# EAGLE design SRAM_MODULE 2.0a (EAGLE 7.2.0)
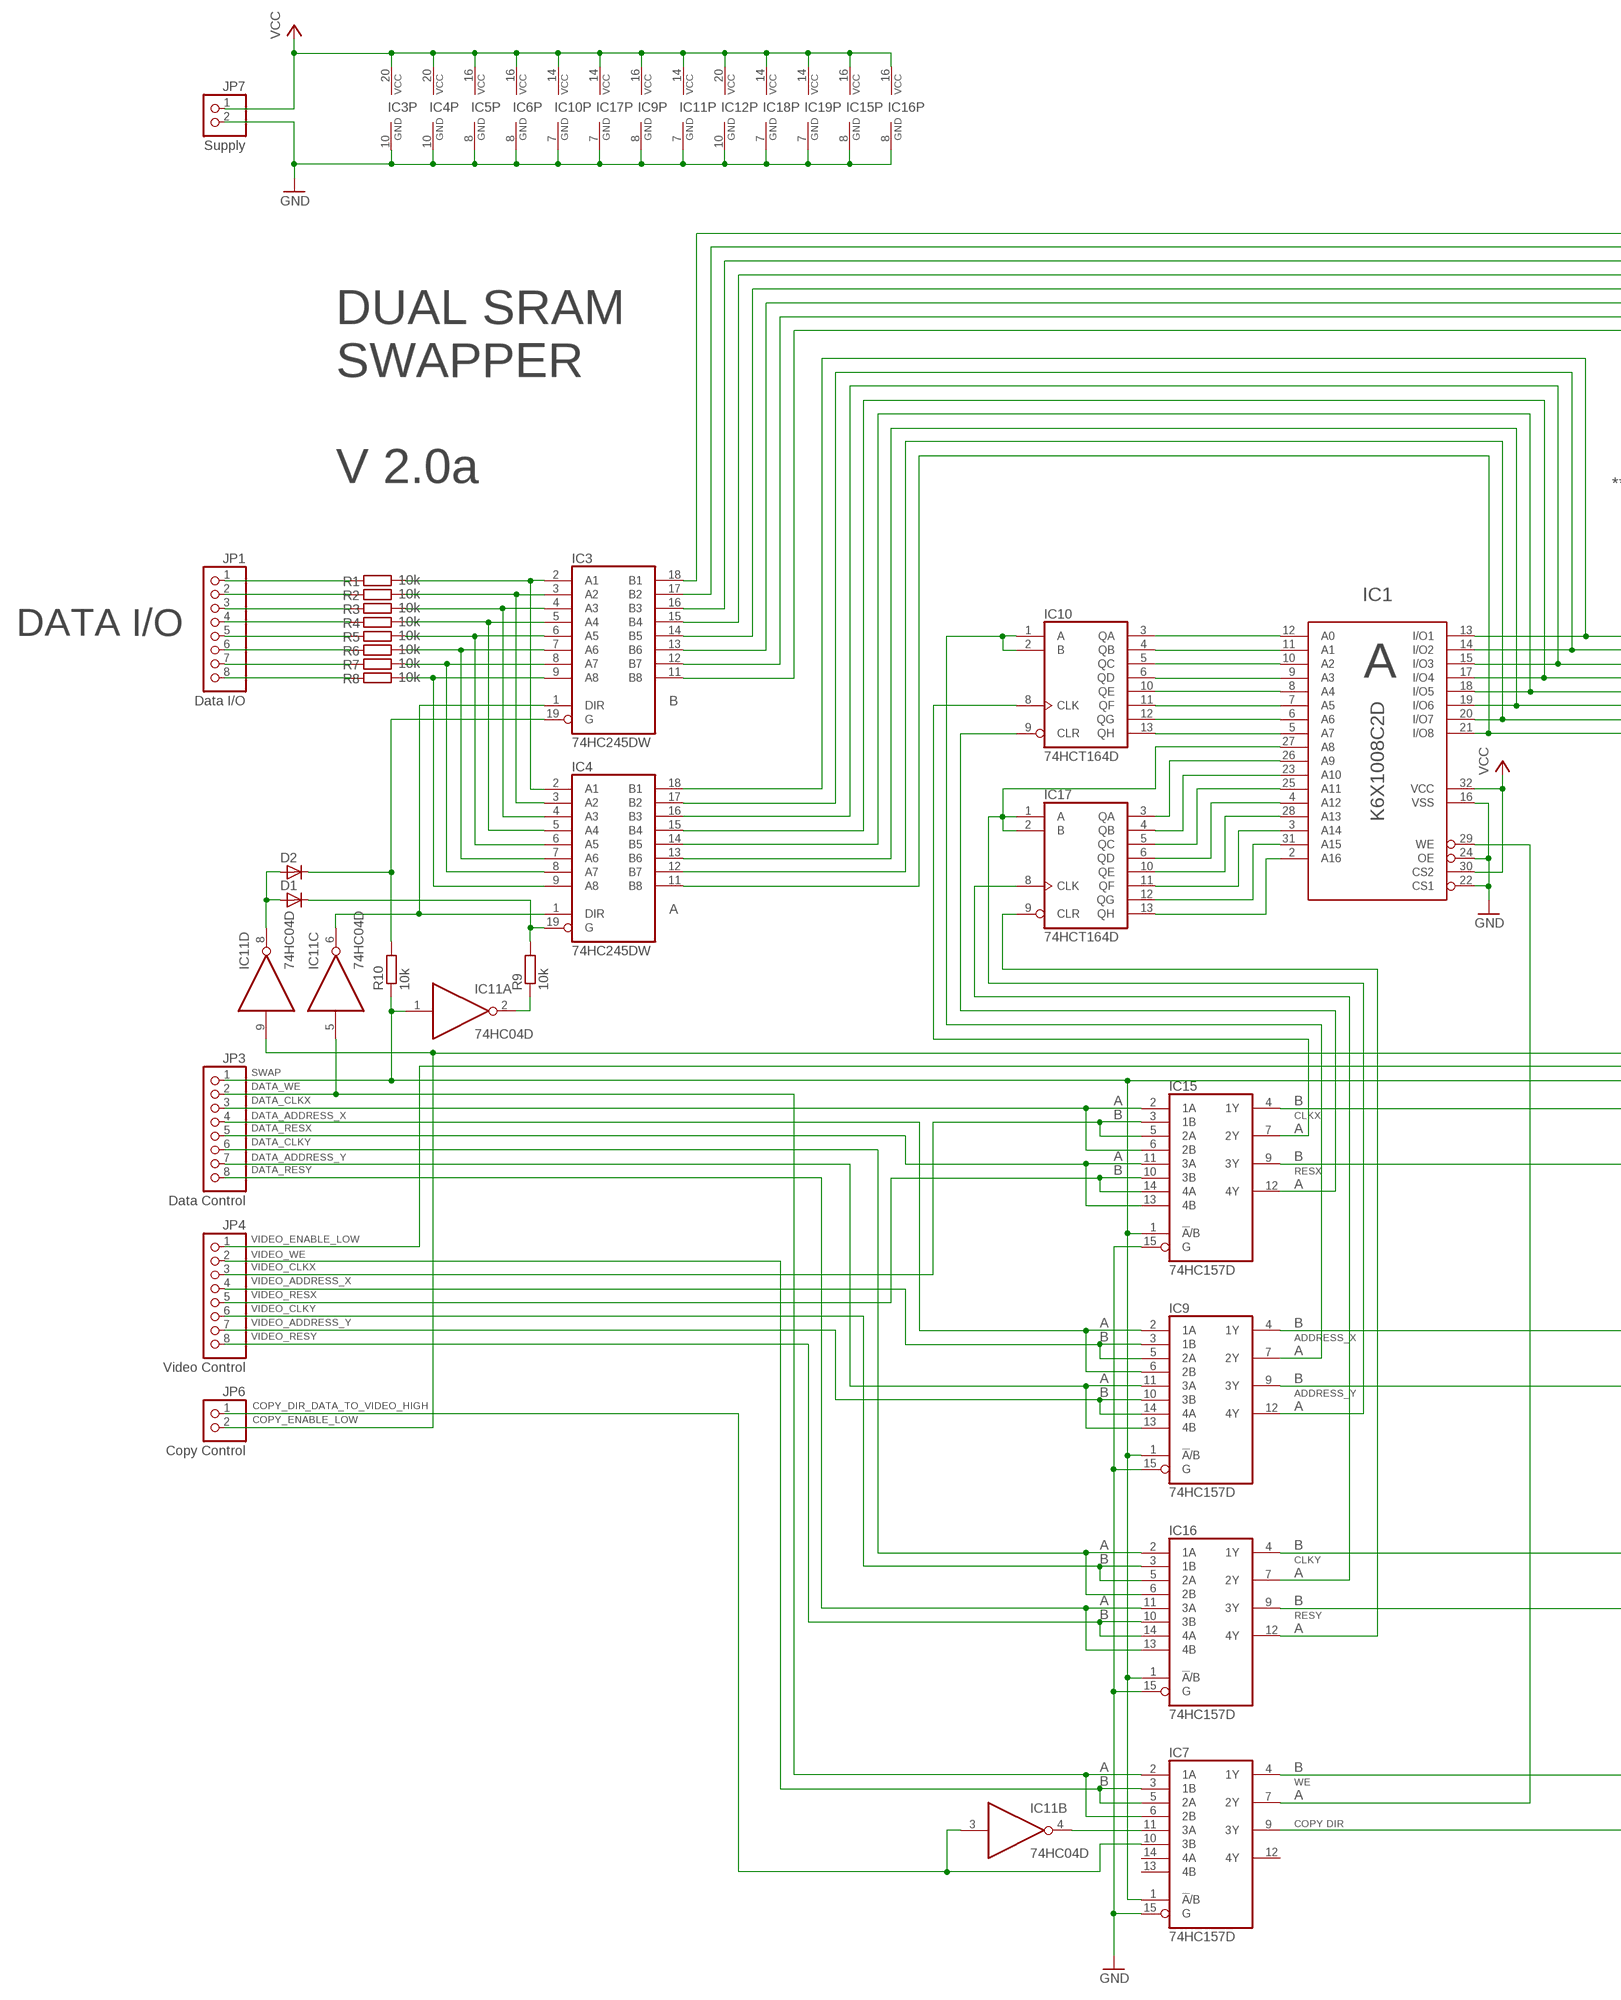
[diagram p0: schematic, sheet 1, part 1 of 2]
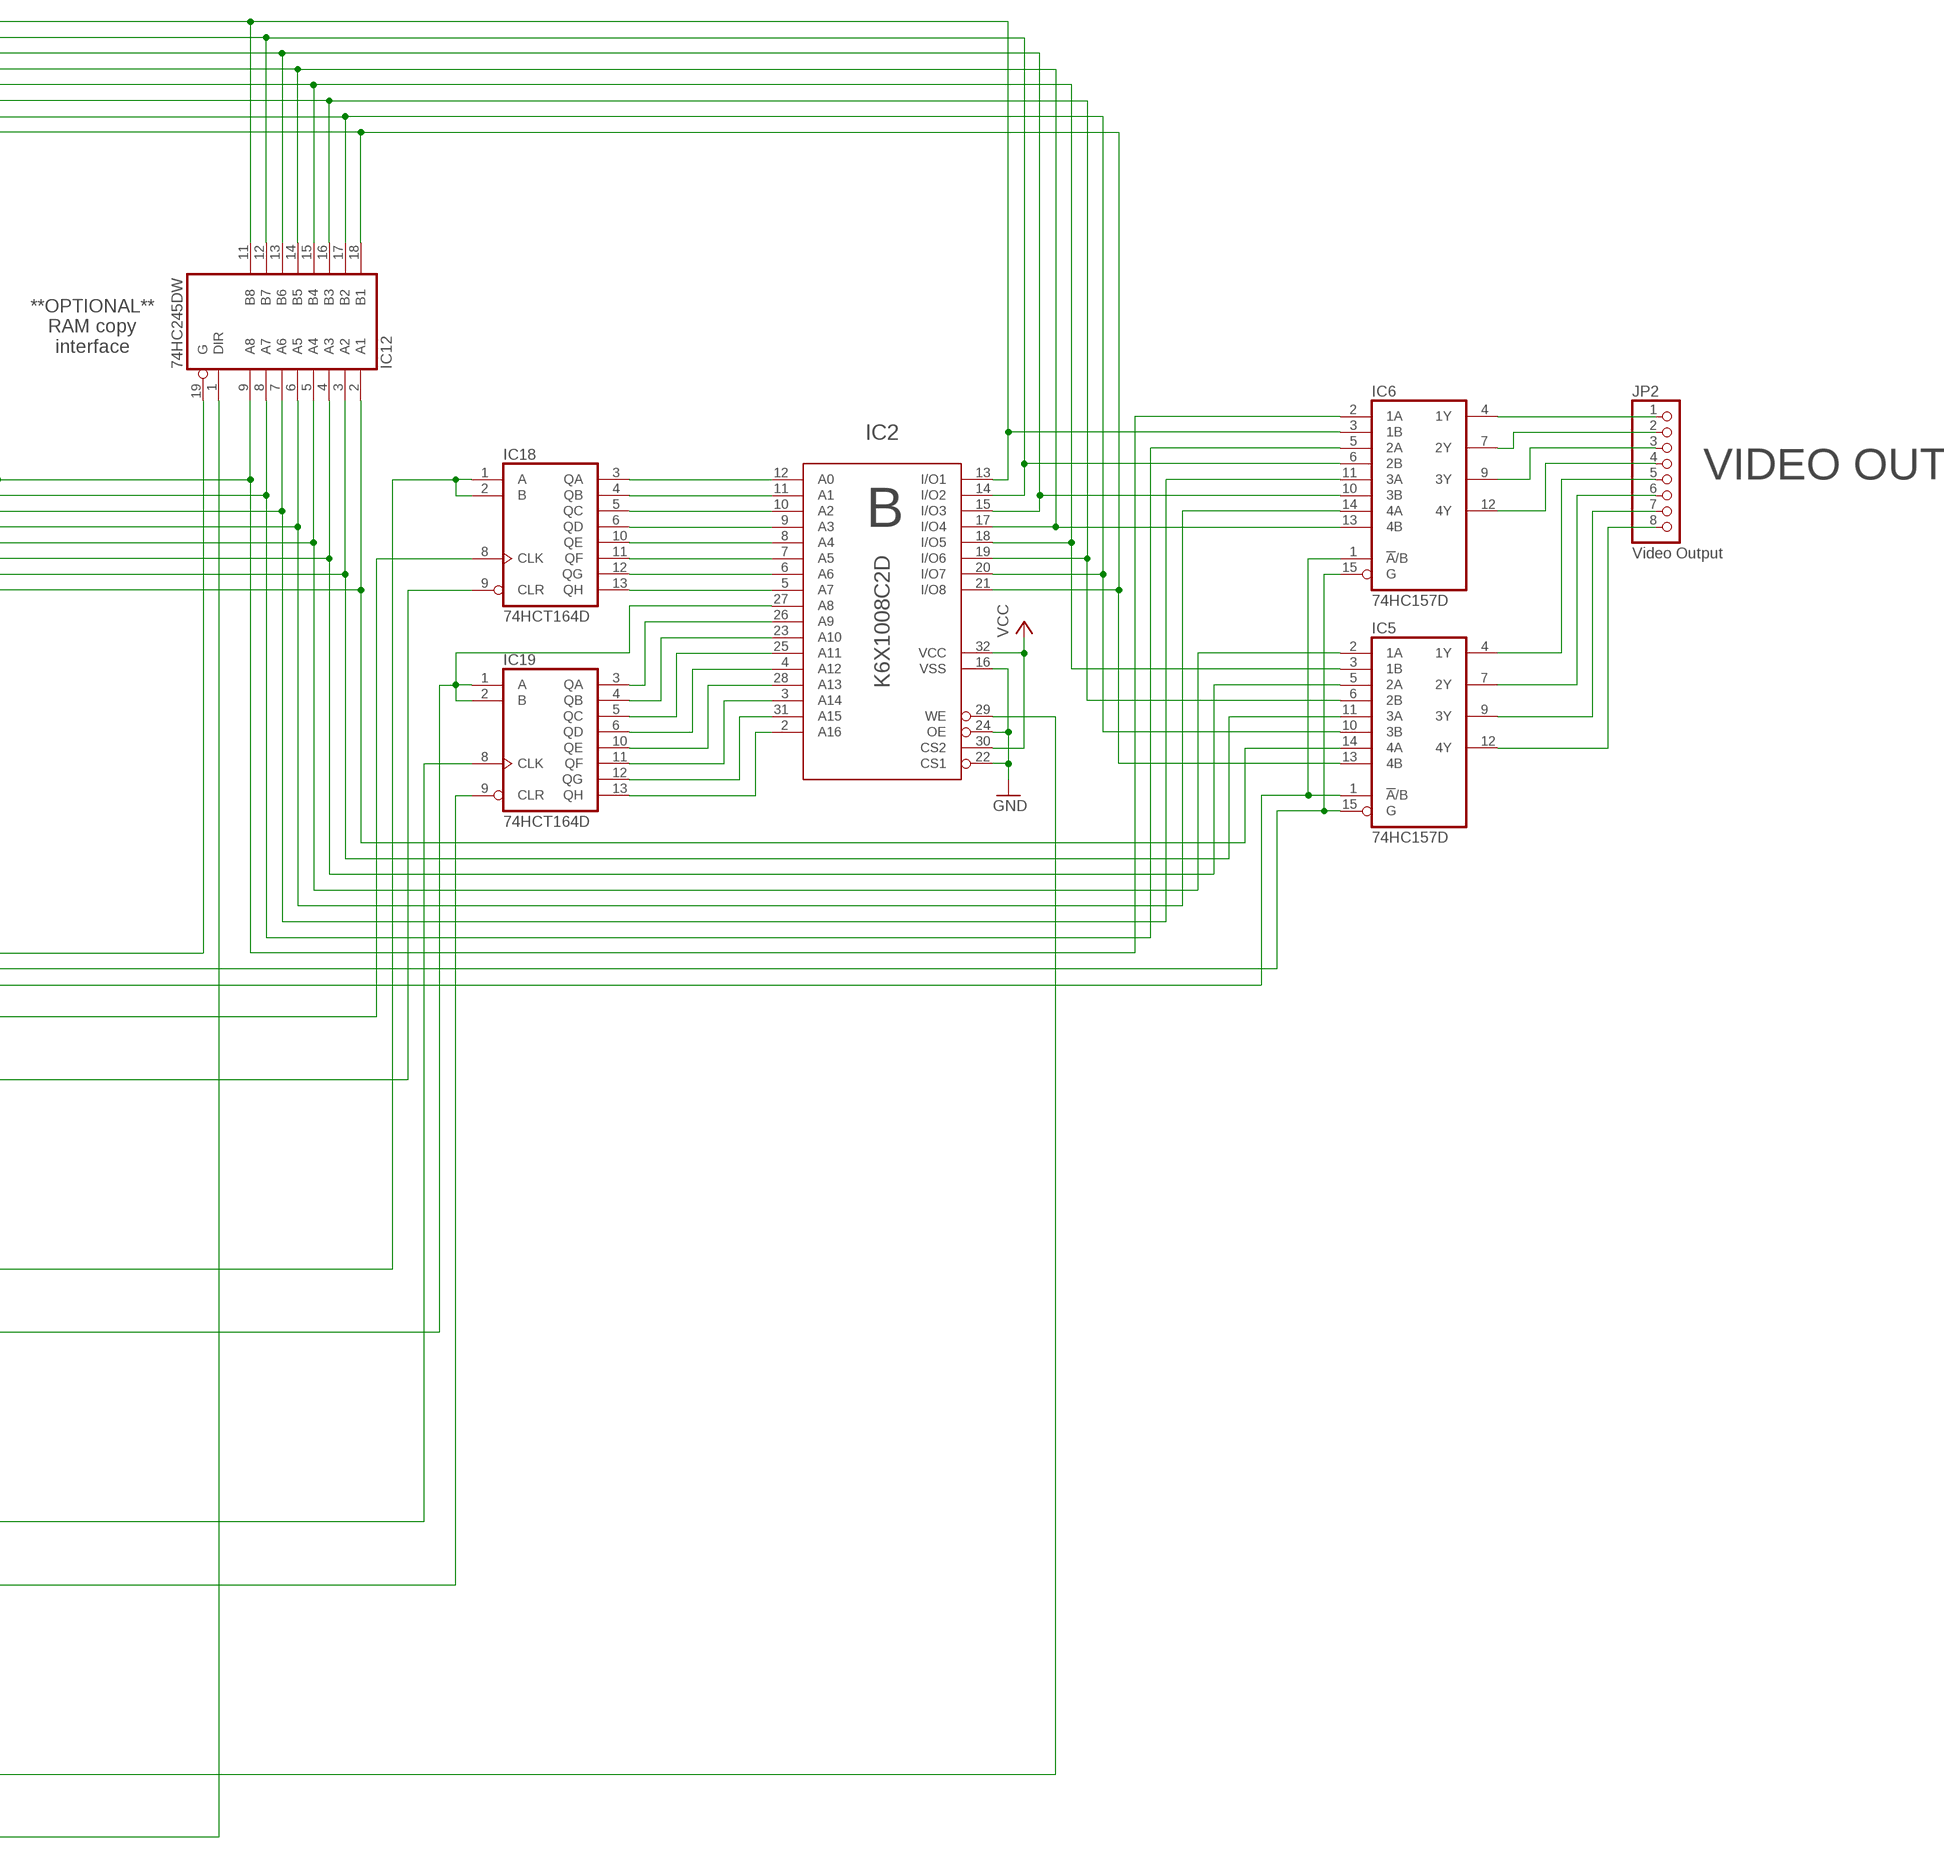
[diagram p1: schematic, sheet 1, part 2 of 2]

## Parts
D1  D-A1-C3  [SOT23]
D2  D-A1-C3  [SOT23]
IC1  K6X1008C2D  [SOP32-5]
IC2  K6X1008C2D  [SOP32-5]
IC3  74HC245DW  [SO20W]
IC4  74HC245DW  [SO20W]
IC5  74HC157D  [SO16]
IC6  74HC157D  [SO16]
IC7  74HC157D  [SO16]
IC9  74HC157D  [SO16]
IC10  74HCT164D  [SO14]
IC11  74HC04D  [SO14]
IC12  74HC245DW  [SO20W]
IC15  74HC157D  [SO16]
IC16  74HC157D  [SO16]
IC17  74HCT164D  [SO14]
IC18  74HCT164D  [SO14]
IC19  74HCT164D  [SO14]
JP1  Data I/O  PINHD-1X8  [1X08]
JP2  Video Output  PINHD-1X8  [1X08]
JP3  Data Control  PINHD-1X8  [1X08]
JP4  Video Control  PINHD-1X8  [1X08]
JP6  Copy Control  PINHD-1X2  [1X02]
JP7  Supply  PINHD-1X2  [1X02]
R1  10k  R-EU_R0603  [R0603]
R2  10k  R-EU_R0603  [R0603]
R3  10k  R-EU_R0603  [R0603]
R4  10k  R-EU_R0603  [R0603]
R5  10k  R-EU_R0603  [R0603]
R6  10k  R-EU_R0603  [R0603]
R7  10k  R-EU_R0603  [R0603]
R8  10k  R-EU_R0603  [R0603]
R9  10k  R-EU_R0603  [R0603]
R10  10k  R-EU_R0603  [R0603]

## Nets
A_ADDRESS_X: IC9.7(2Y) IC10.1(A) IC10.2(B)
A_ADDRESS_Y: IC1.27(A8) IC9.12(4Y) IC17.1(A) IC17.2(B)
A_CLKX: IC10.8(CLK) IC15.7(2Y)
A_CLKY: IC16.7(2Y) IC17.8(CLK)
A_I/O1: IC1.13(I/O1) IC4.18(B1) IC6.2(1A) IC12.9(A8)
A_I/O2: IC1.14(I/O2) IC4.17(B2) IC6.5(2A) IC12.8(A7)
A_I/O3: IC1.15(I/O3) IC4.16(B3) IC6.11(3A) IC12.7(A6)
A_I/O4: IC1.17(I/O4) IC4.15(B4) IC6.14(4A) IC12.6(A5)
A_I/O5: IC1.18(I/O5) IC4.14(B5) IC5.2(1A) IC12.5(A4)
A_I/O6: IC1.19(I/O6) IC4.13(B6) IC5.5(2A) IC12.4(A3)
A_I/O7: IC1.20(I/O7) IC4.12(B7) IC5.11(3A) IC12.3(A2)
A_I/O8: IC1.21(I/O8) IC4.11(B8) IC5.14(4A) IC12.2(A1)
A_RESX: IC10.9(CLR) IC15.12(4Y)
A_RESY: IC16.12(4Y) IC17.9(CLR)
A_WE: IC1.29(WE) IC7.7(2Y)
B_ADDRESS_X: IC9.4(1Y) IC18.1(A) IC18.2(B)
B_ADDRESS_Y: IC2.27(A8) IC9.9(3Y) IC19.1(A) IC19.2(B)
B_CLKX: IC15.4(1Y) IC18.8(CLK)
B_CLKY: IC16.4(1Y) IC19.8(CLK)
B_I/O1: IC2.13(I/O1) IC3.18(B1) IC6.3(1B) IC12.11(B8)
B_I/O2: IC2.14(I/O2) IC3.17(B2) IC6.6(2B) IC12.12(B7)
B_I/O3: IC2.15(I/O3) IC3.16(B3) IC6.10(3B) IC12.13(B6)
B_I/O4: IC2.17(I/O4) IC3.15(B4) IC6.13(4B) IC12.14(B5)
B_I/O5: IC2.18(I/O5) IC3.14(B5) IC5.3(1B) IC12.15(B4)
B_I/O6: IC2.19(I/O6) IC3.13(B6) IC5.6(2B) IC12.16(B3)
B_I/O7: IC2.20(I/O7) IC3.12(B7) IC5.10(3B) IC12.17(B2)
B_I/O8: IC2.21(I/O8) IC3.11(B8) IC5.13(4B) IC12.18(B1)
B_RESX: IC15.9(3Y) IC18.9(CLR)
B_RESY: IC16.9(3Y) IC19.9(CLR)
B_WE: IC2.29(WE) IC7.4(1Y)
COPY_DIR_DATA_TO_VIDEO_HIGH: IC7.10(3B) IC11.3(B:I) JP6.1
COPY_ENABLE_LOW: IC11.9(D:I) IC12.19(G) JP6.2
DATA_ADDRESS_X: IC9.2(1A) IC9.6(2B) JP3.4
DATA_ADDRESS_Y: IC9.11(3A) IC9.13(4B) JP3.7
DATA_CLKX: IC15.2(1A) IC15.6(2B) JP3.3
DATA_CLKY: IC16.2(1A) IC16.6(2B) JP3.6
DATA_RESX: IC15.11(3A) IC15.13(4B) JP3.5
DATA_RESY: IC16.11(3A) IC16.13(4B) JP3.8
DATA_WE: IC7.2(1A) IC7.6(2B) IC11.5(C:I) JP3.2
GND: IC1.16(VSS) IC1.22(CS1) IC1.24(OE) IC2.16(VSS) IC2.22(CS1) IC2.24(OE) IC3.10(GND) IC4.10(GND) IC5.8(GND) IC6.8(GND) IC7.15(G) IC9.8(GND) IC9.15(G) IC10.7(GND) IC11.7(P:GND) IC12.10(GND) IC15.8(GND) IC15.15(G) IC16.8(GND) IC16.15(G) IC17.7(GND) IC18.7(GND) IC19.7(GND) JP7.2
INTERNAL_COPY_DIRECTION: IC7.9(3Y) IC12.1(DIR)
IO1: IC3.2(A1) IC4.2(A1) R1.2
IO2: IC3.3(A2) IC4.3(A2) R2.2
IO3: IC3.4(A3) IC4.4(A3) R3.2
IO4: IC3.5(A4) IC4.5(A4) R4.2
IO5: IC3.6(A5) IC4.6(A5) R5.2
IO6: IC3.7(A6) IC4.7(A6) R6.2
IO7: IC3.8(A7) IC4.8(A7) R7.2
IO8: IC3.9(A8) IC4.9(A8) R8.2
N$1: IC1.12(A0) IC10.3(QA)
N$2: IC7.11(3A) IC11.4(B:O)
N$3: D2.3(C) IC3.19(G) R10.2
N$4: D1.3(C) IC4.19(G) R9.2
N$5: IC1.11(A1) IC10.4(QB)
N$6: IC1.28(A13) IC17.10(QE)
N$7: IC1.10(A2) IC10.5(QC)
N$8: IC1.9(A3) IC10.6(QD)
N$9: IC1.8(A4) IC10.10(QE)
N$10: D1.1(A) D2.1(A) IC11.8(D:O)
N$11: IC1.7(A5) IC10.11(QF)
N$12: IC1.6(A6) IC10.12(QG)
N$13: JP1.8 R8.1
N$14: JP1.7 R7.1
N$15: JP1.6 R6.1
N$16: JP1.5 R5.1
N$17: IC1.5(A7) IC10.13(QH)
N$18: JP1.4 R4.1
N$19: IC1.26(A9) IC17.3(QA)
N$20: IC1.23(A10) IC17.4(QB)
N$21: IC1.25(A11) IC17.5(QC)
N$22: IC1.4(A12) IC17.6(QD)
N$23: IC1.3(A14) IC17.11(QF)
N$24: IC1.31(A15) IC17.12(QG)
N$25: IC1.2(A16) IC17.13(QH)
N$26: JP1.3 R3.1
N$27: IC2.26(A9) IC19.3(QA)
N$28: IC2.23(A10) IC19.4(QB)
N$29: IC2.25(A11) IC19.5(QC)
N$30: IC2.4(A12) IC19.6(QD)
N$31: IC2.28(A13) IC19.10(QE)
N$32: IC2.3(A14) IC19.11(QF)
N$33: IC2.31(A15) IC19.12(QG)
N$34: IC2.2(A16) IC19.13(QH)
N$35: IC2.12(A0) IC18.3(QA)
N$36: IC2.11(A1) IC18.4(QB)
N$37: IC2.10(A2) IC18.5(QC)
N$38: IC2.9(A3) IC18.6(QD)
N$39: IC2.8(A4) IC18.10(QE)
N$40: JP1.2 R2.1
N$41: IC2.7(A5) IC18.11(QF)
N$42: IC2.6(A6) IC18.12(QG)
N$43: IC3.1(DIR) IC4.1(DIR) IC11.6(C:O)
N$44: IC2.5(A7) IC18.13(QH)
N$45: IC11.2(A:O) R9.1
N$46: JP1.1 R1.1
O1: IC6.4(1Y) JP2.1
O2: IC6.7(2Y) JP2.2
O3: IC6.9(3Y) JP2.3
O4: IC6.12(4Y) JP2.4
O5: IC5.4(1Y) JP2.5
O6: IC5.7(2Y) JP2.6
O7: IC5.9(3Y) JP2.7
O8: IC5.12(4Y) JP2.8
SWAP: IC5.1(!A!/B) IC6.1(!A!/B) IC7.1(!A!/B) IC9.1(!A!/B) IC11.1(A:I) IC15.1(!A!/B) IC16.1(!A!/B) JP3.1 R10.1
VCC: IC1.30(CS2) IC1.32(VCC) IC2.30(CS2) IC2.32(VCC) IC3.20(VCC) IC4.20(VCC) IC5.16(VCC) IC6.16(VCC) IC9.16(VCC) IC10.14(VCC) IC11.14(P:VCC) IC12.20(VCC) IC15.16(VCC) IC16.16(VCC) IC17.14(VCC) IC18.14(VCC) IC19.14(VCC) JP7.1
VIDEO_ADDRESS_X: IC9.3(1B) IC9.5(2A) JP4.4
VIDEO_ADDRESS_Y: IC9.10(3B) IC9.14(4A) JP4.7
VIDEO_CLKX: IC15.3(1B) IC15.5(2A) JP4.3
VIDEO_CLKY: IC16.3(1B) IC16.5(2A) JP4.6
VIDEO_ENABLE_LOW: IC5.15(G) IC6.15(G) JP4.1
VIDEO_RESX: IC15.10(3B) IC15.14(4A) JP4.5
VIDEO_RESY: IC16.10(3B) IC16.14(4A) JP4.8
VIDEO_WE: IC7.3(1B) IC7.5(2A) JP4.2
Unconnected: IC7.12(4Y) IC7.13(4B) IC7.14(4A) IC11.10(E:O) IC11.11(E:I) IC11.12(F:O) IC11.13(F:I)

## Notes on the sheet
- DUAL SRAM
  SWAPPER
  
  V 2.0a
- **OPTIONAL**
  RAM copy
  interface
- DATA I/O | VIDEO OUT
- A | B
- B
- A
- A | B
- B | CLKX
- A
- A | B
- B | RESX
- A
- A | B
- B | ADDRESS_X
- A
- A | B
- B | ADDRESS_Y
- A
- A | B
- B | CLKY
- A
- A | B
- B | RESY
- A
- A | B
- B | WE
- A
- COPY DIR

## Power pins joined to a net without a drawn wire
GND: IC7.8(GND)
VCC: IC7.16(VCC)

## Library data of the parts
D1 D2 = semicon-smd-ipc:D-: DIODE unfilled
IC1 IC2 = SRAM:K6X1008C2D: Static RAM SOP32-5; IC1: K6X1008C2D-B
IC3 IC4 IC12 = 74xx-eu:74*245: Octal BUS TRANSCEIVER, 3-state
IC5-IC7 IC9 IC15 IC16 = 74xx-eu:74*157: Quadruple 2-line to 1-line data SELECTOR/MULTIPLEXER
IC10 IC17-IC19 = 74xx-eu:74*164: 8-bit parallel out SHIFT REGISTER
IC11 = 74xx-eu:74*04: Hex INVERTER
JP1-JP4 = pinhead:PINHD-1X8: PIN HEADER
JP6 JP7 = pinhead:PINHD-1X2: PIN HEADER
R1-R10 = rcl:R-EU_: RESISTOR, European symbol

## Board
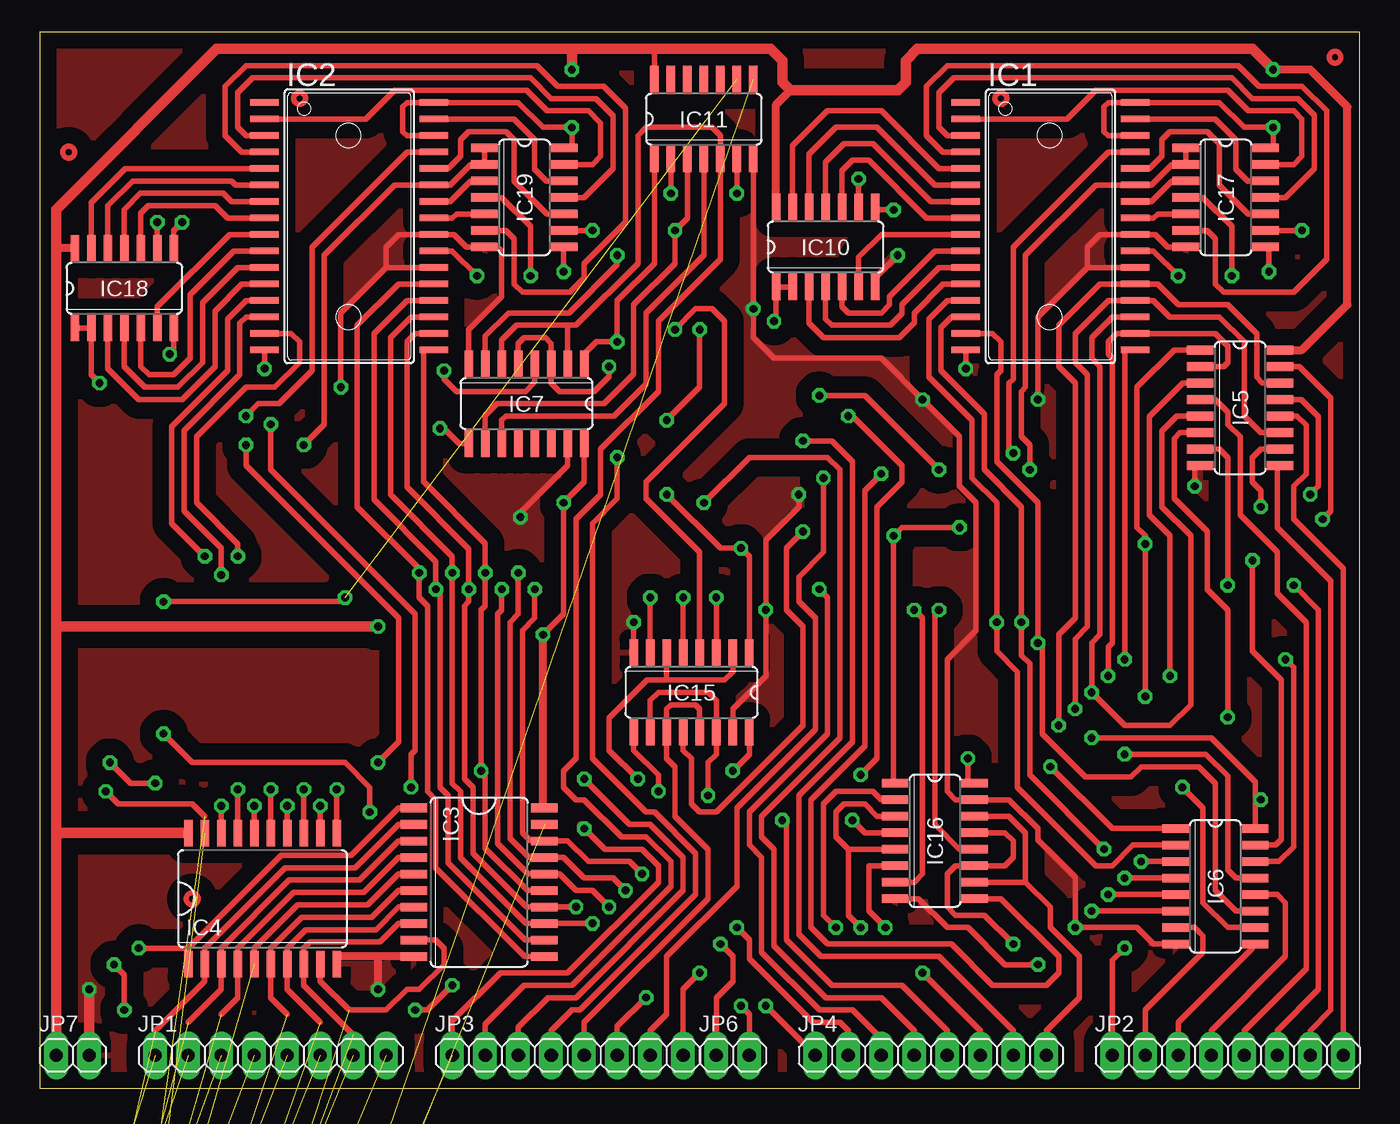
[diagram p2: board, top side]
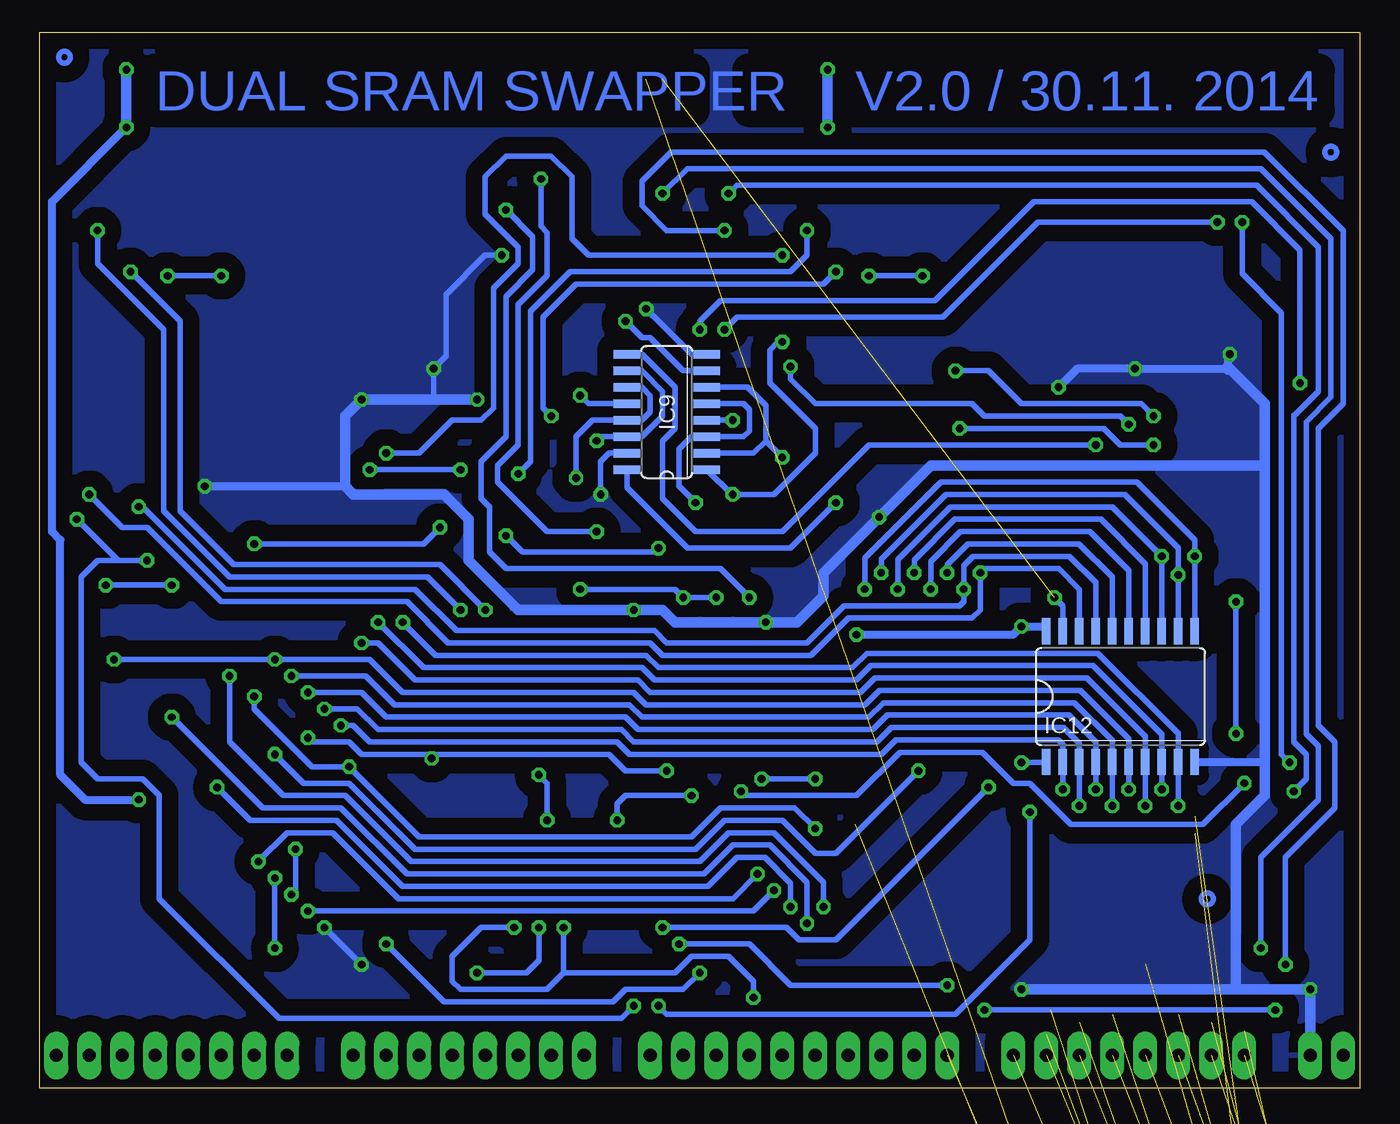
[diagram p3: board, bottom side, seen from below]

Size 101.6 x 81.28 mm. Coordinates in mm from the lower left corner, seen from the top.
Outline: 0,0 101.6,0 101.6,81.28 0,81.28 0,0
Copper layers (1*16): Top 0.035mm / dielectric 1.5mm / Bottom 0.035mm
Design rules "Aroidzap_DesignRules18mil *": minimum track width 16mil, minimum drill 0.6mm, track to track 18mil, track to pad 18mil, pad to pad 18mil, via to via 18mil, smd to smd 16mil, copper to edge 20mil, drill to drill 40mil, minimum pad ring 16mil, minimum via ring 10mil, stop-mask expansion 4mil, vias tented up to drill 0mil, thermal gap 30mil

### Footprints (pad centres in the part's own frame; a part is rotated, then mirrored left to right if it is on the bottom)
SOT23 = smd 1 x 1.4: 1 -0.95,-1.1; 2 0.95,-1.1; 3 0,1.1
SOP32-5 = smd 0.5 x 2.2: 1 -9.525,-6.516; 2 -8.255,-6.516; 3 -6.985,-6.516; 4 -5.715,-6.516; 5 -4.445,-6.516; 6 -3.175,-6.516; 7 -1.905,-6.516; 8 -0.635,-6.516; 9 0.635,-6.516; 10 1.905,-6.516; 11 3.175,-6.516; 12 4.445,-6.516; 13 5.715,-6.516; 14 6.985,-6.516; 15 8.255,-6.516; 16 9.525,-6.516; 17 9.525,6.516; 18 8.255,6.516; 19 6.985,6.516; 20 5.715,6.516; 21 4.445,6.516; 22 3.175,6.516; 23 1.905,6.516; 24 0.635,6.516; 25 -0.635,6.516; 26 -1.905,6.516; 27 -3.175,6.516; 28 -4.445,6.516; 29 -5.715,6.516; 30 -6.985,6.516; 31 -8.255,6.516; 32 -9.525,6.516
SO20W = smd 0.66 x 2.032: 1 -5.715,-5.029; 2 -4.445,-5.029; 3 -3.175,-5.029; 4 -1.905,-5.029; 5 -0.635,-5.029; 6 0.635,-5.029; 7 1.905,-5.029; 8 3.175,-5.029; 9 4.445,-5.029; 10 5.715,-5.029; 11 5.715,5.029; 12 4.445,5.029; 13 3.175,5.029; 14 1.905,5.029; 15 0.635,5.029; 16 -0.635,5.029; 17 -1.905,5.029; 18 -3.175,5.029; 19 -4.445,5.029; 20 -5.715,5.029
SO16 = smd 0.66 x 2.032: 1 -4.445,-3.073; 2 -3.175,-3.073; 3 -1.905,-3.073; 4 -0.635,-3.073; 5 0.635,-3.073; 6 1.905,-3.073; 7 3.175,-3.073; 8 4.445,-3.073; 9 4.445,3.073; 10 3.175,3.073; 11 1.905,3.073; 12 0.635,3.073; 13 -0.635,3.073; 14 -1.905,3.073; 15 -3.175,3.073; 16 -4.445,3.073
SO14 = smd 0.66 x 2.032: 1 -3.81,-3.073; 2 -2.54,-3.073; 3 -1.27,-3.073; 4 0,-3.073; 5 1.27,-3.073; 6 2.54,-3.073; 7 3.81,-3.073; 8 3.81,3.073; 9 2.54,3.073; 10 1.27,3.073; 11 0,3.073; 12 -1.27,3.073; 13 -2.54,3.073; 14 -3.81,3.073
1X08 = drill 1.016 long: 1 -8.89,0; 2 -6.35,0; 3 -3.81,0; 4 -1.27,0; 5 1.27,0; 6 3.81,0; 7 6.35,0; 8 8.89,0
1X02 = drill 1.016 long: 1 -1.27,0; 2 1.27,0
R0603 = smd 1 x 1.1: 1 -0.85,0; 2 0.85,0

### Placement (x,y rotation side)
D1  1.91,-76.83 0 top  (outside the outline)
D2  1.91,-82.55 0 top  (outside the outline)
IC1  77.79,66.36 270 top
IC2  23.81,66.36 270 top
IC3  33.81,15.88 270 top
IC4  17.14,14.61 0 top
IC5  92.39,52.39 270 top
IC6  90.49,15.56 270 top
IC7  37.47,52.7 180 top
IC9  53.34,52.07 90 bottom
IC10  60.48,64.77 0 top
IC11  51.12,74.61 0 top
IC12  18.41,30.16 0 bottom
IC15  50.16,30.48 180 top
IC16  68.9,19.05 270 top
IC17  91.28,68.58 270 top
IC18  6.51,61.59 0 top
IC19  37.31,68.58 270 top
JP1  17.78,2.54 0 top
JP2  91.44,2.54 0 top
JP3  40.64,2.54 0 top
JP4  68.58,2.54 0 top
JP6  53.34,2.54 0 top
JP7  2.54,2.54 0 top
R1  1.27,-24.77 0 top  (outside the outline)
R2  1.27,-29.84 0 top  (outside the outline)
R3  1.27,-34.92 0 top  (outside the outline)
R4  1.27,-40.01 0 top  (outside the outline)
R5  1.27,-45.09 0 top  (outside the outline)
R6  1.27,-50.16 0 top  (outside the outline)
R7  1.27,-55.24 0 top  (outside the outline)
R8  1.27,-60.33 0 top  (outside the outline)
R9  1.27,-65.41 0 top  (outside the outline)
R10  1.27,-70.48 0 top  (outside the outline)

### Tracks (layer width: path | path; a pad name or v marks a point on that pad's centre or on a via)
A_ADDRESS_X  (via drill 0.6)
  Top 0.406: IC10.2 IC10.1 56.67,59.21 v56.52,59.05
  Bottom 0.406: IC9.7 52.07,55.24 54.61,57.78 55.24,57.78 v56.52,59.05
A_ADDRESS_Y  (via drill 0.6, 0.6 pad 0.41)
  Top 0.406: IC17.1 IC17.2 87.15,71.12 85.57,69.53 IC1.27 81.28,69.53 75.88,64.14 75.88,53.98 75.56,53.66 75.56,50.16 76.2,49.53 v76.2,47.62 | v69.22,47.62 63.5,53.34 v60.01,53.34
  Bottom 0.406: v69.22,47.62 v76.2,47.62 | IC9.12 59.37,52.7 v60.01,53.34
A_CLKX  (via drill 0.6)
  Top 0.406: IC10.8 64.29,67.63 v65.72,67.63 | IC15.7 v46.99,37.78
  Bottom 0.406: v65.72,67.63 63.66,65.56 63.66,63.02 65.72,60.96 65.72,50.16 67.63,48.26 67.63,45.4 66.99,44.77 66.99,41.27 65.72,40.01 49.21,40.01 v46.99,37.78
A_CLKY  (via drill 0.6)
  Top 0.406: IC17.8 94.61,64.77 v94.61,62.87 | v67.31,36.83 67.94,36.2 67.94,16.51 67.31,15.88 IC16.7
  Bottom 0.406: v94.61,62.87 90.81,59.05 90.81,44.45 86.68,40.32 70.8,40.32 v67.31,36.83
A_I/O1  (via drill 0.6, 0.6 pad 0.41)
  Top 0.406: IC4.18 v13.97,21.75 | IC1.13 69.85,60.64 68.42,59.21 68.42,54.77 71.75,51.44 71.75,46.99 73.66,45.09 v73.66,35.88 73.66,33.66 75.25,32.07 75.25,23.18 81.28,17.14 82.55,17.14 84.14,18.73 IC6.2
  Bottom 0.406: v13.97,21.75 IC12.9 13.97,27.32 20.14,33.5 37.94,33.5 39.05,32.38 53.98,32.38 54.93,33.34 71.12,33.34 v73.66,35.88
A_I/O2  (via drill 0.6, 0.6 pad 0.41)
  Top 0.406: IC4.17 v15.24,23.02 | IC1.14 70.17,59.37 69.37,58.58 69.37,55.24 72.71,51.91 72.71,47.62 75.56,44.77 v75.56,35.88 75.56,33.34 76.2,32.7 76.2,24.13 v81.92,18.41 | IC6.5 v82.23,14.92
  Bottom 0.406: v15.24,23.02 IC12.8 15.24,27.26 20.53,32.54 37.62,32.54 38.73,31.43 54.29,31.43 55.24,32.38 72.07,32.38 v75.56,35.88 | v81.92,18.41 81.92,15.24 v82.23,14.92
A_I/O3  (via drill 0.6, 0.6 pad 0.41)
  Top 0.406: v16.51,21.75 IC4.16 | IC1.15 73.34,58.1 73.98,57.47 73.98,55.24 73.66,54.93 73.66,48.26 76.83,45.09 v76.83,34.29 77.15,33.97 77.15,27.3 80.49,23.97 83.98,23.97 84.77,24.77 89.22,24.77 90.49,23.5 90.49,15.24 92.08,13.65 IC6.11
  Bottom 0.406: v16.51,21.75 IC12.7 16.51,27.1 21,31.59 37.31,31.59 38.42,30.48 54.61,30.48 55.56,31.43 72.71,31.43 75.56,34.29 v76.83,34.29
A_I/O4  (via drill 0.6)
  Top 0.406: IC4.15 v17.78,23.02 | IC1.17 83.66,56.83 83.5,56.67 v83.5,33.02 | IC6.14 95.38,17.46 96.52,18.61 96.52,32.38 v95.89,33.02
  Bottom 0.406: v17.78,23.02 IC12.6 17.78,26.92 21.5,30.64 36.99,30.64 38.1,29.53 54.93,29.53 55.88,30.48 73.66,30.48 76.2,33.02 v83.5,33.02 v95.89,33.02
A_I/O5  (via drill 0.6)
  Top 0.406: v19.05,21.75 IC4.14 | v82.23,31.75 82.23,33.97 82.55,34.29 82.55,56.2 82.23,56.52 82.23,57.47 82.87,58.1 IC1.18 90.49,58.1 91.44,57.15 91.44,55.88 91.12,55.56 IC5.2
  Bottom 0.406: v19.05,21.75 IC12.5 19.05,26.77 21.97,29.69 36.67,29.69 37.78,28.57 55.24,28.57 56.2,29.53 74.3,29.53 76.52,31.75 v82.23,31.75
A_I/O6  (via drill 0.6)
  Top 0.406: IC4.13 v20.32,23.02 | IC1.19 82.55,59.37 80.96,57.78 80.96,56.2 81.6,55.56 81.6,34.92 80.96,34.29 v80.96,30.48 83.5,27.94 87,27.94 88.58,29.53 88.58,42.55 86.36,44.77 86.36,50.61 87.5,51.75 IC5.5
  Bottom 0.406: v20.32,23.02 IC12.4 20.32,26.67 22.38,28.73 36.35,28.73 37.47,27.62 55.56,27.62 56.52,28.57 74.93,28.57 76.83,30.48 v80.96,30.48
A_I/O7  (via drill 0.6)
  Top 0.406: IC4.12 v21.59,21.75 | IC5.11 93.98,50.48 92.71,51.75 92.71,57.47 90.81,59.37 87,59.37 85.72,60.64 IC1.20 82.23,60.64 79.69,58.1 79.69,55.88 80.64,54.93 80.64,35.56 79.69,34.61 v79.69,29.21
  Bottom 0.406: v21.59,21.75 IC12.3 21.59,26.54 22.83,27.78 36.04,27.78 37.15,26.67 55.88,26.67 56.83,27.62 75.56,27.62 77.15,29.21 v79.69,29.21
A_I/O8  (via drill 0.6)
  Top 0.406: v22.86,23.02 IC4.11 | IC5.14 94.11,54.29 93.66,54.74 93.66,58.1 91.44,60.33 87.63,60.33 86.04,61.91 IC1.21 81.6,61.91 78.42,58.74 78.42,55.56 79.69,54.29 79.69,36.2 78.42,34.92 v78.42,27.94
  Bottom 0.406: v22.86,23.02 IC12.2 22.86,26.47 23.21,26.83 35.72,26.83 36.83,25.72 56.2,25.72 57.15,26.67 76.2,26.67 76.36,26.83 76.52,26.99 77.47,27.94 v78.42,27.94
A_RESX  (via drill 0.6)
  Top 0.406: IC15.12 49.53,26.04 50.16,25.4 50.16,21.91 50.8,21.27 52.07,21.27 58.74,27.94 58.74,35.56 57.47,36.83 57.47,41.59 v58.74,42.86 | IC10.9 v63.02,70.01
  Bottom 0.406: 63.02,69.69 v63.02,70.01 63.02,66.36 62.55,65.88 62.55,62.55 64.77,60.33 64.77,49.53 66.36,47.94 66.36,46.67 62.55,42.86 v58.74,42.86
A_RESY  (via drill 0.6)
  Top 0.406: IC17.9 v97.16,66.04 | IC16.12 70.8,18.41 68.9,20.32 68.9,36.51 v69.22,36.83
  Bottom 0.406: v97.16,66.04 97.16,63.5 92.08,58.42 92.08,44.45 87,39.37 71.75,39.37 v69.22,36.83
A_WE  (via drill 0.6)
  Top 0.406: IC1.29 82.23,72.07 74.93,64.77 74.93,54.61 74.61,54.29 74.61,49.21 v74.93,48.9 | IC7.7 34.29,57.89 36.09,59.69 40.75,59.69 44.45,63.39 v44.45,64.14
  Bottom 0.406: v74.93,48.9 72.39,48.9 69.85,51.44 67.63,51.44 66.67,52.39 66.67,61.59 64.77,63.5 64.77,64.77 67.31,67.31 67.31,70.17 65.72,71.75 62.23,71.75 60.64,70.17 60.64,65.41 59.37,64.14 v44.45,64.14
B_ADDRESS_X  (via drill 0.6, 0.6 pad 0.41)
  Top 0.406: IC18.1 IC18.2 3.97,54.93 v4.6,54.29 | v48.26,51.44 50.8,53.98 v50.8,58.42
  Bottom 0.406: v50.8,58.42 50.8,59.05 49.21,60.64 32.7,60.64 25.08,68.26 8.32,68.26 4.6,64.54 v4.6,54.29 | v48.26,51.44 IC9.4
B_ADDRESS_Y  (via drill 0.6)
  Top 0.406: IC19.1 IC19.2 33.18,71.12 31.59,69.53 IC2.27 27.3,69.53 21.91,64.14 21.91,51.12 v20.32,49.53
  Bottom 0.406: IC9.9 55.24,56.52 52.7,53.98 52.7,50.8 53.66,49.85 53.66,45.4 51.12,42.86 44.45,42.86 37.78,49.53 22.86,49.53 22.23,49.53 v20.32,49.53
B_CLKX  (via drill 0.6)
  Top 0.406: IC18.8 10.32,66.04 v10.95,66.67 | v48.9,58.42 50.48,60.01 51.75,60.01 52.7,59.05 52.7,52.7 46.67,46.67 46.67,45.4 50.8,41.27 IC15.4
  Bottom 0.406: v10.95,66.67 24.77,66.67 32.07,59.37 47.94,59.37 v48.9,58.42
B_CLKY  (via drill 0.6, 0.6 pad 0.41)
  Top 0.406: IC19.8 40.32,64.71 v40.32,62.87 | IC16.4 63.5,19.68 v62.55,20.64 | v63.18,24.13 64.45,25.4 64.45,44.77 66.36,46.67 66.36,47.94 62.55,51.75 v62.23,51.75
  Bottom 0.406: v40.32,62.87 41.27,61.91 60.33,61.91 62.87,59.37 62.87,52.39 v62.23,51.75 | v62.55,20.64 62.55,23.5 v63.18,24.13
B_I/O1  (via drill 0.6)
  Top 0.406: IC2.13 15.88,60.64 14.45,59.21 14.45,55.24 10.16,50.96 10.16,43.5 v12.7,40.96 | IC6.3 v84.77,17.46 | v38.1,38.42 38.1,36.2 37.15,35.24 37.15,19.68 37.78,19.05 IC3.18 40.64,19.05 42.23,17.46 45.4,17.46 v46.35,16.51
  Bottom 0.406: v38.1,38.42 38.1,40.82 32.25,46.67 17.14,46.67 12.7,42.23 v12.7,40.96 IC12.11 | v84.77,17.46 82.55,19.68 79.06,19.68 73.98,14.61 48.26,14.61 v46.35,16.51
B_I/O2  (via drill 0.6)
  Top 0.406: IC2.14 15.88,59.37 15.4,58.9 15.4,54.93 11.11,50.64 11.11,44.45 13.97,41.59 v13.97,39.53 | v36.83,39.69 36.83,36.51 36.2,35.88 36.2,19.24 37.66,17.78 IC3.17 40.32,17.78 41.91,16.19 44.13,16.19 v45.09,15.24 | IC6.6 v80.96,13.65
  Bottom 0.406: v36.83,39.69 36.83,40.76 31.87,45.72 18.1,45.72 13.97,41.59 v13.97,39.53 IC12.12 | v80.96,13.65 46.67,13.65 v45.09,15.24
B_I/O3  (via drill 0.6)
  Top 0.406: IC2.15 19.37,58.1 20,57.47 20,55.88 18.1,53.98 15.88,53.98 12.06,50.16 12.06,45.09 15.24,41.91 v15.24,40.96 | IC6.10 91.44,12.38 89.53,14.29 89.53,21.59 v87.95,23.18 | v35.56,38.42 35.56,36.83 35.24,36.51 35.24,18.86 37.59,16.51 IC3.16 40.01,16.51 41.27,15.24 42.55,15.24 v43.81,13.97
  Bottom 0.406: v35.56,38.42 35.56,40.7 31.49,44.77 19.05,44.77 v15.24,40.96 IC12.13 | v43.81,13.97 43.81,15.8 45.8,17.78 47.94,17.78 50.16,15.56 73.66,15.56 78.74,20.64 85.41,20.64 v87.95,23.18
B_I/O4  (via drill 0.6, 0.6 pad 0.41)
  Top 0.406: IC3.15 37.53,15.24 34.29,18.48 34.29,24.13 v33.97,24.45 33.97,36.83 34.29,37.15 v34.29,39.69 34.29,41.96 29.53,46.72 29.53,56.83 IC2.17 | IC6.13 92.08,16.19 91.44,16.83 91.44,24.04 89.76,25.72 v83.5,25.72
  Bottom 0.406: IC12.14 16.51,40.38 19.94,43.81 31.16,43.81 34.29,40.69 v34.29,39.69 | v83.5,25.72 81.28,23.5 77.79,23.5 72.71,18.41 51.12,18.41 48.9,20.64 44.45,20.64 41.91,18.1 40.32,18.1 v33.97,24.45
B_I/O5  (via drill 0.6)
  Top 0.406: IC2.18 28.89,58.1 28.26,57.47 28.26,46.29 33.02,41.52 v33.02,38.42 33.02,37.47 32.7,37.15 32.7,23.81 33.34,23.18 33.34,18.11 37.48,13.97 IC3.14 v41.27,13.97 | IC5.3 87.97,54.29 85.41,51.73 85.41,44.13 87,42.55 v87,31.75
  Bottom 0.406: v33.02,38.42 33.02,40.57 30.73,42.86 20.77,42.86 17.78,39.87 IC12.15 | v87,31.75 87,26.67 82.87,22.54 78.11,22.54 73.03,17.46 50.8,17.46 48.58,19.68 45.09,19.68 41.27,15.88 v41.27,13.97
B_I/O6  (via drill 0.6)
  Top 0.406: IC2.19 28.57,59.37 26.99,57.78 26.99,45.72 31.75,40.96 v31.75,39.69 31.75,23.5 32.38,22.86 32.38,17.74 37.42,12.7 IC3.13 v42.55,12.7 | IC5.6 87.76,50.48 87.31,50.03 87.31,45.4 89.85,42.86 89.85,38.42 91.44,36.83 v91.44,28.57
  Bottom 0.406: IC12.16 19.05,39.35 21.61,41.91 30.16,41.91 31.75,40.32 v31.75,39.69 | v91.44,28.57 84.45,21.59 78.42,21.59 73.34,16.51 50.48,16.51 48.26,18.73 45.4,18.73 42.55,15.88 v42.55,12.7
B_I/O7  (via drill 0.6)
  Top 0.406: IC3.12 37.37,11.43 31.43,17.36 31.43,22.54 30.8,23.18 30.8,38.1 v30.48,38.42 30.48,40.56 25.72,45.33 25.72,58.1 28.26,60.64 IC2.20 | IC5.10 93.98,49.21 93.34,48.58 93.34,46.67 93.98,46.04 v93.98,44.77
  Bottom 0.406: IC12.17 20.32,38.92 22.35,40.96 29.77,40.96 30.48,40.25 v30.48,38.42 30.48,37.47 30.8,37.15 39.69,37.15 42.55,34.29 53.34,34.29 54.29,35.24 69.53,35.24 72.71,38.42 87.31,38.42 93.66,44.77 v93.98,44.77
B_I/O8  (via drill 0.6)
  Top 0.406: IC3.11 37.31,10.16 30.48,16.99 30.48,22.23 29.84,22.86 29.84,37.15 29.21,37.78 v29.21,39.69 29.21,40.01 24.45,44.77 24.45,58.74 27.62,61.91 IC2.21 | IC5.13 97.12,53.02 98.42,51.71 98.42,46.35 v97.79,45.72
  Bottom 0.406: IC12.18 21.59,38.42 23.18,40.01 28.89,40.01 v29.21,39.69 29.21,36.83 29.84,36.2 39.37,36.2 42.23,33.34 53.66,33.34 54.61,34.29 70.17,34.29 73.34,37.47 87.63,37.47 93.34,43.18 95.25,43.18 v97.79,45.72
B_RESX  (via drill 0.6, 0.6 pad 0.41)
  Top 0.406: IC18.9 v9.05,66.67 | IC15.9 45.72,26.04 47.62,24.13 v47.62,22.86 | v8.89,23.5 6.99,23.5 v5.4,25.08
  Bottom 0.406: v47.62,22.86 47.31,22.54 38.73,22.54 35.4,25.88 29.05,25.88 26.67,23.5 25.4,23.5 22.23,20.32 12.06,20.32 v8.89,23.5 | v9.05,66.67 9.05,62.71 6.03,59.69 6.03,25.72 v5.4,25.08
B_RESY  (via drill 0.6)
  Top 0.406: IC19.9 v42.55,66.04 | IC16.9 73.98,14.61 78.42,10.16 78.42,8.89 77.47,7.94 73.34,7.94 70.17,11.11 60.64,11.11 59.37,12.38 59.37,22.23 63.5,26.35 63.5,46.04 v64.77,47.31
  Bottom 0.406: v42.55,66.04 42.55,64.14 43.81,62.87 60.8,62.87 63.82,59.85 63.82,48.26 v64.77,47.31
B_WE  (via drill 0.6, 0.6 pad 0.41)
  Top 0.406: IC2.29 28.26,72.07 20.95,64.77 20.95,55.24 18.41,52.7 16.83,52.7 v15.88,51.75 | IC7.4 38.1,54.37 37.39,53.66 32.07,53.66 31.11,54.61 v31.11,55.24
  Bottom 0.406: v31.11,55.24 28.57,55.24 26.04,52.7 16.83,52.7 v15.88,51.75
COPY_DIR_DATA_TO_VIDEO_HIGH  (via drill 0.6, 0.6 pad 0.41)
  Top 0.406: JP6.1 52.07,6.99 53.34,8.26 53.34,10.16 v52.39,11.11 | IC7.10 34.29,51.81 35.19,52.7 43.43,52.7 45.72,54.99 45.72,60.33 48.9,63.5 v48.9,66.04 49.85,66.99 IC11.3 | v5.71,9.53 6.51,8.73 v6.51,6.03 | v28.89,6.03 29.84,6.03 v31.75,7.94
  Bottom 0.406: v52.39,11.11 46.99,11.11 43.81,7.94 v31.75,7.94 | v48.9,66.04 53.34,66.04 55.24,67.94 55.24,69.83 53,72.07 7.34,72.07 1.27,66.01 1.27,52.7 3.17,50.8 3.17,27.94 1.91,26.67 1.91,21.59 5.71,17.78 v5.71,9.53 | v6.51,6.03 v28.89,6.03
COPY_ENABLE_LOW  (via drill 0.6)  (1 unrouted)
  Top 0.406: v53.98,6.35 54.61,5.71 JP6.2 | v25.4,21.27 25.4,23.18 23.5,25.08 11.75,25.08 v9.53,27.3 | v23.5,37.78 23.18,37.47 v9.53,37.47
  Bottom 0.406: v53.98,6.35 53.34,5.71 31.11,5.71 25.4,11.43 v25.4,21.27 | v9.53,27.3 v9.53,37.47 | IC12.19 22.86,37.15 v23.5,37.78
DATA_ADDRESS_X  (via drill 0.6)
  Top 0.406: JP3.4 39.37,4.45 40.96,6.03 41.59,6.03 50.48,14.92 50.48,18.1 47.31,21.27 46.67,21.27 42.55,25.4 42.55,43.5 44.45,45.4 v44.45,48.58
  Bottom 0.406: IC9.6 47.14,53.98 45.72,52.55 45.72,49.85 | IC9.2 46.67,48.9 45.72,49.85 | v44.45,48.58 45.72,49.85
DATA_ADDRESS_Y  (via drill 0.6 pad 0.41)
  Top 0.406: JP3.7 46.99,4.45 48.26,5.71 48.26,10.16 53.66,15.56 53.66,21.59 59.69,27.62 59.69,36.2 58.42,37.47 58.42,39.37 60.33,41.27 v60.33,46.99
  Bottom 0.406: IC9.11 55.24,53.98 54.61,53.34 54.61,52.07 55.24,51.44 IC9.13 59.05,51.44 60.33,50.16 v60.33,46.99
DATA_CLKX  (via drill 0.6 pad 0.41)
  Top 0.406: JP3.3 36.83,4.7 39.12,6.99 41.27,6.99 49.53,15.24 49.53,17.78 46.99,20.32 45.4,20.32 v41.91,23.81 | IC15.6 48.26,31.43 | 48.26,31.43 52.7,31.43 53.34,32.07 IC15.2 | 48.26,31.43 46.74,31.43 43.81,28.5 43.81,26.04 v46.04,23.81
  Bottom 0.406: v41.91,23.81 v46.04,23.81
DATA_CLKY  (via drill 0.6)
  Top 0.406: JP3.6 44.45,4.76 v46.67,6.99 | IC16.6 63.82,17.14 63.82,13.65 v65.09,12.38 | IC16.2 64.77,22.23 64.14,22.86 61.28,22.86 60.33,21.91 60.33,13.34 v61.28,12.38
  Bottom 0.406: 61.28,8.89 52.7,8.89 51.44,10.16 48.58,10.16 46.67,8.26 v46.67,6.99 | 61.28,8.89 62.55,7.62 69.22,7.62 69.85,8.26 69.85,10.16 67.63,12.38 v65.09,12.38 | v61.28,12.38 61.28,8.89
DATA_RESX
  Top 0.406: JP3.5 41.91,5.08 51.44,14.61 51.44,18.41 48.9,20.95 48.9,24.77 48.26,25.4 IC15.11 48.26,29.21 48.58,29.53 50.48,29.53 50.8,29.21 IC15.13
DATA_RESY  (via drill 0.6)
  Top 0.406: JP3.8 49.53,7.62 v50.8,8.89 | IC16.13 74.3,19.68 74.93,19.05 74.93,17.78 74.3,17.14 IC16.11 70.48,17.14 69.85,16.51 69.85,13.97 70.48,13.34 72.71,13.34 v74.93,11.11
  Bottom 0.406: v50.8,8.89 52.07,7.62 56.52,7.62 57.47,6.67 70.48,6.67 v74.93,11.11
DATA_WE
  Top 0.406: JP3.2 34.29,4.94 37.28,7.94 40.96,7.94 48.58,15.56 48.58,17.46 46.67,19.37 44.77,19.37 41.91,22.23 41.27,22.23 40.32,23.18 40.32,24.45 41.27,25.4 41.27,43.81 43.18,45.72 43.18,49.21 47.62,53.66 47.62,59.05 52.39,63.82 IC11.5 52.39,73.34 51.75,73.98 46.67,73.98 46.04,73.34 46.04,63.5 41.27,58.74 40.64,58.74 | IC7.6 35.56,57.59 36.7,58.74 40.64,58.74 | 40.64,58.74 IC7.2
GND  (via drill 0.6, 0.6 pad 0.41)
  Top 0.406: IC18.7 10.32,56.83 v10,56.52 | v17.3,55.4 IC2.16 | IC2.22 26.67,63.18 | 26.67,63.18 23.18,59.69 v23.18,53.98 | IC17.7 86.84,64.77 85.88,65.72 IC1.24 81.6,65.72 80.64,64.77 80.64,63.18 | IC1.22 80.64,63.18 | 80.64,63.18 76.83,59.37 v76.83,53.02 | IC1.16 71.27,55.41 v71.28,55.4 | IC5.8 88.9,47.94 v88.9,46.35 | IC6.8 85.72,11.11 84.45,12.38 v79.69,12.38 79.69,16.25 76.83,19.11 76.83,20 74.61,22.23 IC16.15 70.48,22.23 69.85,22.86 69.85,33.02 72.07,35.24 72.07,45.09 70.8,46.35 70.8,50.16 v67.94,53.02 64.77,56.2 56.52,56.2 54.93,57.78 v54.93,60.01 IC11.7 | 26.67,63.18 26.67,64.77 27.62,65.72 IC2.24 31.91,65.72 32.86,64.77 IC19.7 35.24,64.77 35.56,64.45 35.56,60.96 33.02,58.42 IC7.8 | IC16.8 67.63,14.61 69.85,12.38 71.44,12.38 74.3,9.53 v76.83,9.53 | IC7.15 40.64,47.94 36.99,44.29 v36.99,43.97 | IC15.8 v45.72,35.88 | IC15.15 53.34,29.21 55.88,31.75 v55.88,36.83 55.88,42.23 58.42,44.77 v58.42,45.72 | IC10.7 64.29,62.39 v66.04,64.14
  Top 0.61: IC4.10 22.86,10.16 26.04,10.16 | IC3.10 26.04,10.16 | v26.04,7.62 26.04,10.16
  Top 0.813: JP7.2 v3.81,7.62
  Bottom 0.406: 71.28,53.02 v71.28,55.4 70.33,56.36 70.33,61.12 67.31,64.14 v66.04,64.14 | v76.83,9.53 v79.69,12.38 | v54.93,60.01 51.44,56.52 IC9.8 | IC9.15 57.78,48.9 58.42,48.26 v58.42,45.72
  Bottom 0.61: IC12.10 7.3,25.13 7.3,24.77 | v88.9,46.35 78.11,46.35 | v23.18,53.98 21.75,55.4 v17.3,55.4 10.32,55.4 10.16,55.24 10.16,55.56 10.16,56.36 v10,56.52
  Bottom 0.813: 9.53,7.62 v3.81,7.62 JP7.2 | 9.53,7.62 v26.04,7.62 | 7.3,47.94 7.3,24.77 7.3,22.54 9.53,20.32 9.53,7.62 | 7.3,47.94 7.3,52.7 10.16,55.56 | v67.94,53.02 71.28,53.02 v76.83,53.02 78.11,51.75 78.11,46.35 77.47,45.72 70.48,45.72 68.58,43.81 68.58,40.64 64.77,36.83 v55.88,36.83 53.66,36.83 52.7,35.88 v45.72,35.88 43.31,35.88 41.27,37.91 41.27,39.69 v36.99,43.97 33.02,47.94 7.3,47.94
  pour Top (isolate 1.27): 0,81.28 101.6,81.28 101.6,0 0,0
  pour Bottom (isolate 1.27): 0,81.28 101.6,81.28 101.6,0 0,0
INTERNAL_COPY_DIRECTION  (via drill 0.6, 0.6 pad 0.41)
  Top 0.406: IC7.9 32.28,49.63 31.11,50.8 v30.8,50.8 | v26.04,25.08 27.62,26.67 27.62,36.2 15.88,47.94 v15.88,49.53
  Bottom 0.406: v30.8,50.8 19.68,50.8 18.41,49.53 v15.88,49.53 | IC12.1 24.18,25.08 v26.04,25.08
IO1  (1 unrouted)
  Top 0.406: IC3.2 27.62,20.32 24.29,16.99 18.89,16.99 12.7,10.79 IC4.2 12.7,8.26 8.89,4.45
IO2  (1 unrouted)
  Top 0.406: IC3.3 27.62,19.05 24.61,16.03 19.21,16.03 13.97,10.79 IC4.3 13.97,7.62 11.43,5.08
IO3  (1 unrouted)
  Top 0.406: IC3.4 27.62,17.78 24.92,15.08 19.53,15.08 15.24,10.79 IC4.4 15.24,6.99 13.97,5.71
IO4  (1 unrouted)
  Top 0.406: IC4.5 16.51,10.79 19.84,14.13 25.24,14.13 27.62,16.51 IC3.5
IO5  (1 unrouted)
  Top 0.406: 19.05,5.71 17.78,6.99 IC4.6 17.78,10.79 20.16,13.18 25.56,13.18 27.62,15.24 IC3.6
IO6  (1 unrouted)
  Top 0.406: IC3.7 27.62,13.97 25.88,12.22 20.48,12.22 19.05,10.79 IC4.7 19.05,7.62 21.59,5.08
IO7  (1 unrouted)
  Top 0.406: IC3.8 27.62,12.7 26.19,11.27 20.8,11.27 20.32,10.79 IC4.8 20.32,7.94 24.13,4.13
IO8  (1 unrouted)
  Top 0.406: IC4.9 21.59,8.26 23.81,6.03 26.67,6.03 28.26,7.62 29.21,7.62 31.11,9.53 31.11,10.79 30.48,11.43 IC3.9
N$1
  Top 0.406: IC1.12 69.53,61.91 67.31,59.69 67.31,58.93 66.17,57.78 60.33,57.78 59.21,58.9 IC10.3
N$2
  Top 0.406: IC7.11 35.56,51.44 35.88,51.75 44.19,51.75 46.67,54.23 46.67,59.69 51.12,64.14 IC11.4
N$3  (2 unrouted)
N$4  (2 unrouted)
N$5
  Top 0.406: IC1.11 69.22,63.18 66.36,60.33 66.36,59.64 65.46,58.74 60.96,58.74 60.48,59.21 IC10.4
N$6
  Top 0.406: IC17.10 93.03,67.31 90.81,69.53 90.81,72.71 89.85,73.66 87,73.66 86.36,73.03 86.36,71.75 85.41,70.8 IC1.28
N$7
  Top 0.406: IC1.10 68.9,64.45 65.41,60.96 65.41,60.33 64.77,59.69 62.23,59.69 61.75,60.17 IC10.5
N$8
  Top 0.406: IC10.6 63.02,63.98 64.77,65.72 IC1.9
N$9
  Top 0.406: IC10.10 61.75,70.64 62.55,71.44 63.82,71.44 68.26,66.99 IC1.8
N$10  (2 unrouted)
N$11
  Top 0.406: IC10.11 60.48,71.28 61.91,72.71 64.14,72.71 68.58,68.26 IC1.7
N$12
  Top 0.406: IC10.12 59.21,71.91 61.28,73.98 64.45,73.98 68.9,69.53 IC1.6
N$13  (1 unrouted)
N$14  (1 unrouted)
N$15  (1 unrouted)
N$16  (1 unrouted)
N$17
  Top 0.406: IC10.13 57.94,72.55 60.64,75.25 64.77,75.25 69.22,70.8 IC1.5
N$18  (1 unrouted)
N$19
  Top 0.406: IC17.3 87.15,69.85 85.57,68.26 IC1.26
N$20  (via drill 0.6)
  Top 0.406: IC1.23 85.72,64.45 v87.63,62.55 | v91.76,62.55 91.76,66.36 89.53,68.58 IC17.4
  Bottom 0.406: v87.63,62.55 v91.76,62.55
N$21
  Top 0.406: IC1.25 85.72,66.99 86.04,67.31 IC17.5
N$22
  Top 0.406: IC17.6 89.85,66.04 90.49,65.41 90.49,61.91 91.12,61.28 96.52,61.28 99.06,63.82 99.06,75.25 97.16,77.15 93.82,77.15 92.23,78.74 69.85,78.74 68.26,77.15 68.26,73.34 69.53,72.07 IC1.4
N$23
  Top 0.406: IC1.3 69.85,73.34 69.22,73.98 69.22,76.64 70.36,77.79 91.76,77.79 93.34,76.2 96.84,76.2 98.11,74.93 98.11,70.8 95.89,68.58 IC17.11
N$24
  Top 0.406: IC1.31 90.49,74.61 92.08,73.03 92.08,70.75 92.97,69.85 IC17.12
N$25
  Top 0.406: IC17.13 96.52,71.12 97.16,71.75 97.16,74.61 96.52,75.25 93.03,75.25 91.44,76.83 81.28,76.83 79.06,74.61 IC1.2
N$26  (1 unrouted)
N$27
  Top 0.406: IC2.26 31.59,68.26 33.18,69.85 IC19.3
N$28  (via drill 0.6)
  Top 0.406: IC2.23 31.75,64.45 v33.66,62.55 | IC19.4 35.56,68.58 37.78,66.36 v37.78,62.55
  Bottom 0.406: v37.78,62.55 v33.66,62.55
N$29
  Top 0.406: IC2.25 31.75,66.99 32.07,67.31 IC19.5
N$30
  Top 0.406: IC19.6 35.88,66.04 36.51,65.41 36.51,61.91 37.15,61.28 40.81,61.28 41.91,62.37 41.91,63.5 45.09,66.67 45.09,75.44 43.38,77.15 39.85,77.15 38.26,78.74 15.88,78.74 14.29,77.15 14.29,73.34 15.56,72.07 IC2.4
N$31
  Top 0.406: IC2.28 31.43,70.8 32.38,71.75 32.38,73.03 33.02,73.66 35.88,73.66 36.51,73.03 36.51,69.85 39.05,67.31 IC19.10
N$32
  Top 0.406: IC19.11 41.91,68.58 44.13,70.8 44.13,74.89 42.82,76.2 39.37,76.2 37.78,77.79 16.39,77.79 15.24,76.64 15.24,73.98 15.88,73.34 IC2.3
N$33
  Top 0.406: IC2.31 36.51,74.61 38.1,73.03 38.1,70.75 39,69.85 IC19.12
N$34
  Top 0.406: IC2.2 25.08,74.61 27.3,76.83 37.47,76.83 39.05,75.25 42.23,75.25 43.18,74.3 43.18,71.75 42.55,71.12 IC19.13
N$35
  Top 0.406: IC18.3 5.24,55.4 7.62,53.02 10.95,53.02 13.49,55.56 13.49,59.85 15.56,61.91 IC2.12
N$36
  Top 0.406: IC18.4 6.51,55.56 8.1,53.98 10.64,53.98 12.54,55.88 12.54,60.48 15.24,63.18 IC2.11
N$37
  Top 0.406: IC18.5 7.78,55.56 8.41,54.93 10.32,54.93 11.59,56.2 11.59,61.12 14.92,64.45 IC2.10
N$38
  Top 0.406: IC18.6 9.05,60.17 14.61,65.72 IC2.9
N$39
  Top 0.406: IC18.10 7.78,67.37 8.35,67.94 13.49,67.94 14.45,66.99 IC2.8
N$40  (1 unrouted)
N$41
  Top 0.406: IC18.11 6.51,67.66 7.75,68.9 14.13,68.9 14.76,68.26 IC2.7
N$42
  Top 0.406: IC18.12 5.24,67.94 7.15,69.85 14.76,69.85 15.08,69.53 IC2.6
N$43  (via drill 0.6)
  Top 0.406: IC3.1 27.62,21.59 23.97,17.94 18.57,17.94 11.43,10.79 | IC11.6 v53.66,68.9 | 11.43,10.79 IC4.1 | v7.62,10.79 11.43,10.79
  Bottom 0.406: v53.66,68.9 51.75,70.8 7.63,70.8 2.22,65.4 2.22,53.22 4.13,51.31 4.13,27.3 3.17,26.35 3.17,22.23 7.62,17.78 v7.62,10.79
N$44
  Top 0.406: IC2.5 6.57,70.8 3.97,68.2 IC18.13
N$45  (via drill 0.6)  (1 unrouted)
  Top 0.406: IC11.2 v48.58,68.9 | 12.7,20.95 11.75,21.91 6.03,21.91 v5.08,22.86
  Bottom 0.406: v5.08,22.86 4.13,23.81 4.13,25.72 5.08,26.67 5.08,51.83 5,51.83 3.17,53.66 3.17,64.77 7.94,69.53 47.94,69.53 v48.58,68.9
N$46  (1 unrouted)
O1  (via drill 0.6)
  Top 0.406: IC6.4 v83.5,16.19 | JP2.1 82.55,9.84 v83.5,10.79
  Bottom 0.406: v83.5,16.19 v83.5,10.79
O2
  Top 0.406: JP2.2 85.09,6.03 89.53,10.48 89.53,11.75 88.9,12.38 IC6.7
O3
  Top 0.406: JP2.3 87.63,5.08 93.34,10.79 93.34,11.11 IC6.9
O4
  Top 0.406: IC6.12 95.25,14.92 95.89,14.29 95.89,10.16 90.17,4.45 JP2.4
O5
  Top 0.406: JP2.5 92.71,4.45 97.47,9.21 97.47,35.88 95.25,38.1 95.25,41.27 92.39,44.13 92.39,50.16 91.44,51.12 91.44,52.07 90.49,53.02 IC5.4
O6  (via drill 0.6)
  Top 0.406: IC5.7 90.81,49.21 91.44,48.58 v91.44,38.73 | JP2.6 95.25,4.45 98.42,7.62 98.42,36.83 v96.52,38.73
  Bottom 0.406: v96.52,38.73 v91.44,38.73
O7
  Top 0.406: IC5.9 95.25,47.94 95.25,43.18 99.38,39.05 99.38,6.03 97.79,4.45 JP2.7
O8
  Top 0.406: IC5.12 96.76,51.75 97.47,51.04 97.47,47.31 96.52,46.35 96.52,43.81 100.33,40.01 JP2.8
SWAP  (via drill 0.6, 0.6 pad 0.41)  (1 unrouted)
  Top 0.406: IC5.1 87.31,56.83 84.45,53.98 84.45,43.18 85.09,42.55 v85.09,41.91 v85.09,30.16 | JP3.1 31.75,5.19 35.45,8.89 40.64,8.89 47.62,15.88 47.62,17.14 46.35,18.41 43.5,18.41 v41.91,20 41.59,20.32 | IC7.1 41.91,56.52 42.86,57.47 v44.45,57.47 44.45,60.64 47.31,63.5 IC11.1 | IC6.1 82.55,20 v77.79,24.77 | v48.26,45.72 52.39,41.59 v53.98,41.59 54.61,40.96 IC15.1 | v70.8,43.18 66.36,43.18 v65.72,42.55 65.72,23.6 IC16.1
  Bottom 0.406: v85.09,30.16 85.09,29.21 80.64,24.77 v77.79,24.77 72.39,19.37 51.44,19.37 49.21,21.59 43.5,21.59 v41.91,20 | v70.8,43.18 72.07,41.91 v85.09,41.91 | v44.45,57.47 44.77,57.47 45.4,56.83 45.4,54.29 41.91,50.8 41.91,48.9 45.09,45.72 v48.26,45.72 48.26,45.62 IC9.1 49.85,47.62 | v65.72,42.55 64.45,41.27 54.29,41.27 v53.98,41.59
VCC  (via drill 0.6, 0.6 pad 0.41)
  Top 0.406: IC2.30 28.26,73.34 27.94,73.66 27.94,75.56 28.26,75.88 IC2.32 36.83,75.88 38.73,73.98 v40.96,73.98 40.96,72.39 IC19.14 | IC1.30 82.23,73.34 81.92,73.66 81.92,75.56 82.23,75.88 IC1.32 90.81,75.88 92.71,73.98 v94.93,73.98 94.93,72.39 IC17.14 | IC3.20 39.37,21.59 | IC11.14 47.31,79.69 46.99,80.01 | v71.44,25.4 71.44,23.5 IC16.16 | IC6.16 93.56,22.23 | 93.56,22.23 93.56,23.6 90.17,26.99 v80.96,26.99 | v93.98,22.23 93.56,22.23 | v38.73,34.92 40.32,36.51 v40.32,45.09 41.91,46.67 IC7.16 | IC15.16 54.61,25.72 v53.34,24.45
  Top 0.61: IC18.14 1.37,64.67 1.27,64.77 | IC5.16 97.16,56.83 100.65,60.33 100.65,75.56 97.79,78.42 v94.93,78.42 | IC4.20 11.38,19.68 11.11,19.68 | 39.37,21.59 38.73,21.59 v38.73,34.92 | IC10.14 56.67,75.72 57.78,76.83
  Top 0.813: v94.93,78.42 93.34,80.01 67.57,80.01 66.67,79.11 66.67,77.47 66.04,76.83 57.78,76.83 57.15,77.47 57.15,79.11 56.25,80.01 46.99,80.01 40.96,80.01 | 40.96,80.01 13.62,80.01 1.27,67.66 1.27,64.77 1.27,35.56 | v40.96,78.42 40.96,80.01 | JP7.1 1.27,19.68 | 1.27,19.68 1.27,35.56 | 11.11,19.68 1.27,19.68 | v26.04,35.56 1.27,35.56
  Bottom 0.406: 71.44,25.72 76.83,25.72 77.79,26.67 80.64,26.67 v80.96,26.99 | v53.34,24.45 56.52,24.45 57.78,25.72 71.44,25.72 | v71.44,25.4 71.44,25.72 | IC9.16 56.41,46.25 51.75,41.59 43.81,41.59 v40.32,45.09
  Bottom 0.61: v94.93,73.98 100.65,68.26 100.65,42.86 100.01,42.23 100.01,24.13 98.11,22.23 v93.98,22.23 | v38.73,34.92 26.67,34.92 v26.04,35.56 24.13,35.56 IC12.20
  Bottom 0.813: v40.96,78.42 v40.96,73.98 | v94.93,78.42 v94.93,73.98
VIDEO_ADDRESS_X  (via drill 0.6 pad 0.41)
  Top 0.406: JP4.4 67.31,4.45 64.77,6.99 60.52,6.99 56.52,10.99 56.52,18.41 55.56,19.37 55.56,20.95 61.59,26.99 61.59,47.62 60.64,48.58 54.61,48.58 v51.12,45.09
  Bottom 0.406: IC9.5 47.44,52.7 46.99,52.26 46.99,50.61 47.44,50.16 IC9.3 51.44,50.16 52.39,49.21 52.39,46.35 v51.12,45.09
VIDEO_ADDRESS_Y  (via drill 0.6)
  Top 0.406: JP4.7 74.93,4.45 69.22,10.16 60.13,10.16 58.42,11.88 58.42,22.54 62.55,26.67 62.55,48.26 60.96,49.85 v58.74,49.85
  Bottom 0.406: IC9.10 55.24,55.24 53.66,53.66 53.66,51.75 55.24,50.16 IC9.14 58.42,50.16 v58.74,49.85
VIDEO_CLKX  (via drill 0.6)
  Top 0.406: JP4.3 64.77,3.81 62.55,6.03 60.01,6.03 55.56,10.48 55.56,17.78 54.61,18.73 54.61,21.27 60.64,27.3 60.64,37.78 v60.01,38.42 | IC15.3 v52.07,37.78 | v49.53,37.78 IC15.5
  Bottom 0.406: v49.53,37.78 v52.07,37.78 52.7,38.42 v60.01,38.42
VIDEO_CLKY  (via drill 0.6)
  Top 0.406: JP4.6 72.39,4.45 v67.94,8.89 | IC16.3 64.45,20.95 63.5,21.91 61.91,21.91 61.28,21.27 61.28,19.37 62.23,18.41 | 62.23,18.41 IC16.5 | 62.23,18.41 62.23,13.34 v63.18,12.38
  Bottom 0.406: v63.18,12.38 63.18,9.84 64.14,8.89 v67.94,8.89
VIDEO_ENABLE_LOW  (via drill 0.6)
  Top 0.406: IC5.15 96.96,55.56 99.38,53.14 99.38,44.45 v98.74,43.81 | v93.34,40.64 93.34,33.66 95.57,31.43 95.57,19.18 95.12,18.73 IC6.15 | v55.88,6.35 JP4.1
  Bottom 0.406: v98.74,43.81 95.73,40.8 | 95.73,40.8 95.57,40.64 | v93.34,40.64 95.89,40.64 | 95.89,40.64 97.16,40.64 98.42,39.37 98.42,25.08 97.16,23.81 93.66,23.81 92.39,22.54 92.39,14.61 83.19,5.4 56.83,5.4 v55.88,6.35 | 95.89,40.64 95.73,40.8
VIDEO_RESX  (via drill 0.6 pad 0.41)
  Top 0.406: JP4.5 69.85,4.45 66.36,7.94 60.97,7.94 57.47,11.44 57.47,20.32 v57.15,20.64 | IC15.10 46.99,29.84 47.62,30.48 51.44,30.48 52.07,29.84 IC15.14 52.07,25.72 51.44,25.08 v51.44,22.54
  Bottom 0.406: v57.15,20.64 57.15,21.91 56.52,22.54 v51.44,22.54
VIDEO_RESY
  Top 0.406: IC16.10 75.88,15.88 | IC16.14 74.61,20.95 75.88,19.68 75.88,15.88 | JP4.8 77.47,4.45 80.01,6.99 80.01,10.16 77.79,12.38 77.79,13.97 75.88,15.88
VIDEO_WE  (via drill 0.6, 0.6 pad 0.41)
  Top 0.406: IC7.5 36.83,57.34 37.28,57.78 38.92,57.78 39.37,57.34 IC7.3 39.37,54.29 40.01,53.66 42.67,53.66 43.81,54.8 v43.81,55.56 | JP4.2 62.23,4.45 61.59,5.08 59.5,5.08 54.61,9.97 54.61,11.43 v53.66,12.38 | v28.57,23.18 28.57,25.72 28.89,26.04 28.89,36.51 17.78,47.62 v17.78,51.12
  Bottom 0.406: v53.66,12.38 44.13,12.38 43.18,11.43 40.32,11.43 v28.57,23.18 | v43.81,55.56 43.81,54.61 41.91,52.7 29.84,52.7 28.89,51.75 18.41,51.75 v17.78,51.12
(copper drawn outside any net)
  shapes: Bottom circle x4, Top circle x5

### Text on the board
Bottom: V2.0 / 30.11. 2014 | DUAL SRAM SWAPPER
tDocu: CC | VCC | GND | IO1 | IO2 | IO3 | IO4 | IO5 | IO6 | IO7 | IO8 | SWAP | DATA_WE | DATA_CLKX | DATA_ADDRESS_X | DATA_RESX | DATA_CLKY | DATA_ADDRESS_Y | DATA_RESY | COPY_DIR | COPY ENABLE | VIDEO_ENABLE | VIDEO_WE | VIDEO_CLKX | VIDEO_ADDRESS_X | VIDEO_RESX | VIDEO_CLKY | VIDEO_ADDRESS_Y | VIDEO_RESY | O1 | O2 | O3 | O4 | O5 | O6 | O7 | O8